# Altium schematic sheet MFR-25FBF52-10K1_MFR-25FBF52-10K.schdoc
size 127 x 99 mm
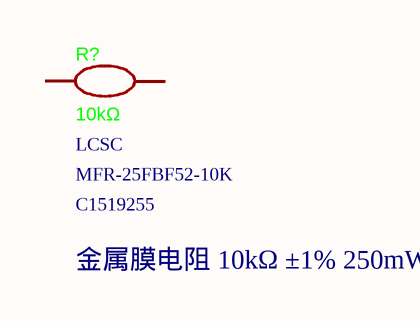
[diagram p0: MFR-25FBF52-10K1_MFR-25FBF52-10K.schdoc]

## Parts
R?  10kΩ  Supplier: LCSC  Supplier Part: C1519255  LCSC Part Name: 金属膜电阻 10kΩ ±1% 250mW  [RES-TH_BD2.4-L6.3-P10.30-D0.6]

## Nets

Not connected (* = marked no-connect by the designer): R? 1 2

## Library data of the parts
R? = MFR-25FBF52-10K: Manufacturer: YAGEO(国巨); Add into BOM: yes; Tolerance: ±1%; Power(Watts): 250mW; Temperature Coefficient: ±100ppm/℃; Symbol: MFR-25FBF52-10K; Device: MFR-25FBF52-10K; Manufacturer Part: MFR-25FBF52-10K; Supplier Footprint: 插件,D2.4xL6.3mm; JLCPCB Part Class: Extended Part; Datasheet: https://atta.szlcsc.com/upload/public/pdf/source/20210908/3C41728C91B3E25B71017F60FFBE4CE1.pdf; Convert to PCB: yes; Type: Metal Film Resistors; Value: 10kΩ; Operating Temperature Range: -55℃~+155℃